# Altium schematic sheet Sheet1.SchDoc
size A4
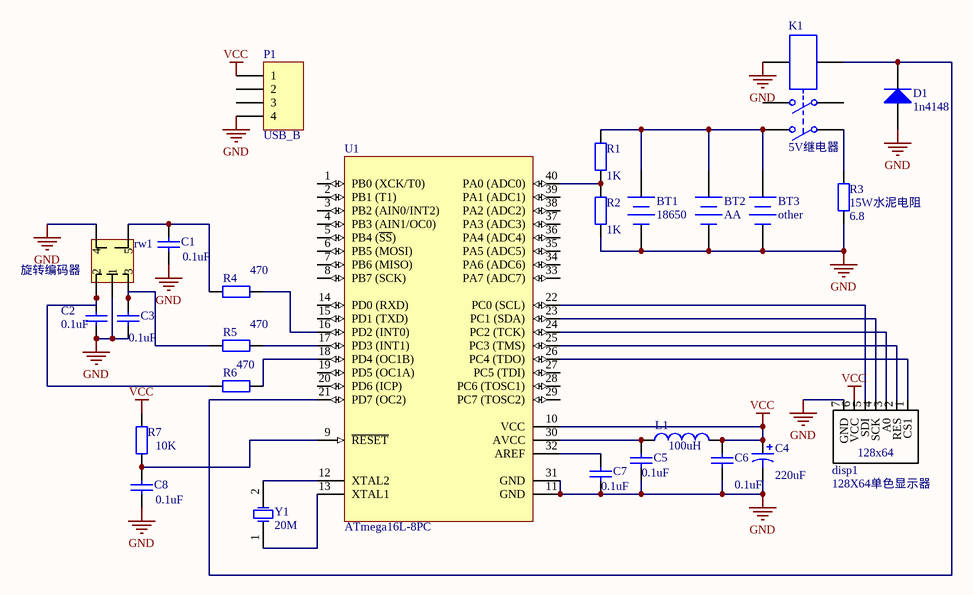
[diagram p0: Sheet1.SchDoc]

## Parts
BT1  18650  [18650battery]
BT2  AA  [aabattery]
BT3  other  [Header2_3.96]
C1  value 0.1uF  [RAD-0.2]  (hidden comment: Cap)
C2  value 0.1uF  [RAD-0.2]  (hidden comment: Cap)
C3  value 0.1uF  [RAD-0.2]  (hidden comment: Cap)
C4  value 220uF  [RB5-10.5]  (hidden comment: Cap Pol1)
C5  value 0.1uF  [RAD-0.2]  (hidden comment: Cap)
C6  value 0.1uF  [RAD-0.2]  (hidden comment: Cap)
C7  value 0.1uF  [RAD-0.2]  (hidden comment: Cap)
C8  value 0.1uF  [RAD-0.2]  (hidden comment: Cap)
D1  1n4148  [DIO10.46-5.3x2.8]
disp1  128X64单色显示器  [mzl05_12864]
K1  5V继电器  [5vrelay]
L1  value 100uH  [AXIAL-0.5]  (hidden comment: Inductor)
P1  USB_B  [USB_B]
R1  value 1K  [AXIAL-0.4]  (hidden comment: Res2)
R2  value 1K  [AXIAL-0.4]  (hidden comment: Res2)
R3  15W水泥电阻  value 6.8  [R_15W]
R4  value 470  [AXIAL-0.4]  (hidden comment: Res2)
R5  value 470  [AXIAL-0.4]  (hidden comment: Res2)
R6  value 470  [AXIAL-0.4]  (hidden comment: Res2)
R7  value 10K  [AXIAL-0.4]  (hidden comment: Res2)
rw1  旋转编码器  [rotate_switch]
U1  ATmega16L-8PC  [40P6]
Y1  20M  [XTAL]

## Nets
GND: BT1.2(-) BT2.2(-) BT3.2(-) C1.2 C2.2 C3.2 C4.2 C5.1 C6.2 C7.1 C8.1 D1.1(A) disp1.7(GND) K1.6 P1.4 R2.1 R3.1 rw1.1 rw1.4 U1.11(GND) U1.31(GND)
VCC: C4.1 C6.1 disp1.6(VCC) L1.2 P1.1 R7.2 U1.10(VCC)
NetBT1_1: BT1.1(+) BT2.1(+) BT3.1(+) K1.2 R1.2
NetC1_1: C1.1 R4.1 rw1.5
NetC2_1: C2.1 R6.1 rw1.2
NetC3_1: C3.1 R5.1 rw1.3
NetC5_2: C5.2 L1.1 U1.30(AVCC)
NetC7_2: C7.2 U1.32(AREF)
NetC8_2: C8.2 R7.1 U1.9(~{RESET})
NetD1_2: D1.2(K) K1.5 U1.21(PD7_(OC2))
Netdisp1_1: disp1.1(CS1) U1.26(PC4_(TDO))
Netdisp1_2: disp1.2(RES) U1.25(PC3_(TMS))
Netdisp1_3: disp1.3(A0) U1.24(PC2_(TCK))
Netdisp1_4: disp1.4(SCK) U1.23(PC1_(SDA))
Netdisp1_5: disp1.5(SDI) U1.22(PC0_(SCL))
NetK1_1: K1.1 R3.2
NetR1_1: R1.1 R2.2 U1.40(PA0_(ADC0))
NetR4_2: R4.2 U1.16(PD2_(INT0))
NetR5_2: R5.2 U1.17(PD3_(INT1))
NetR6_2: R6.2 U1.18(PD4_(OC1B))
NetU1_12: U1.12(XTAL2) Y1.2(OSC2)
NetU1_13: U1.13(XTAL1) Y1.1(OSC1)

Not connected (* = marked no-connect by the designer): K1 3 4; P1 2 3; U1 1(PB0_(XCK/T0)) 2(PB1_(T1)) 3(PB2_(AIN0/INT2)) 4(PB3_(AIN1/OC0)) 5(PB4_(~{SS})) 6(PB5_(MOSI)) 7(PB6_(MISO)) 8(PB7_(SCK)) 14(PD0_(RXD)) 15(PD1_(TXD)) 19(PD5_(OC1A)) 20(PD6_(ICP)) 27(PC5_(TDI)) 28(PC6_(TOSC1)) 29(PC7_(TOSC2)) 33(PA7_(ADC7)) 34(PA6_(ADC6)) 35(PA5_(ADC5)) 36(PA4_(ADC4)) 37(PA3_(ADC3)) 38(PA2_(ADC2)) 39(PA1_(ADC1))

## Notes on the sheet
- (in symbol mzl05_12864) 128x64

## Library data of the parts
BT1-BT3 = Battery: Multicell Battery; Published: 24-Mar-1999; LatestRevisionDate: 17-Jul-2002; LatestRevisionNote: Re-released for DXP Platform.; PackageReference: BAT-2; Publisher: Altium Limited
C1-C3 C5-C8 = Cap: Capacitor; Published: 8-Jun-2000; LatestRevisionDate: 17-Jul-2002; LatestRevisionNote: Re-released for DXP Platform.; PackageReference: RAD-0.3; Publisher: Altium Limited
C4 = Cap Pol1: Polarized Capacitor (Radial); Published: 8-Jun-2000; LatestRevisionDate: 17-Jul-2002; LatestRevisionNote: Re-released for DXP Platform.; PackageReference: RB7.6-15; Publisher: Altium Limited
D1 = Diode 1N4001: 1 Amp General Purpose Rectifier; Published: 8-Jun-2000; LatestRevisionDate: 17-Jul-2002; LatestRevisionNote: Re-released for DXP Platform.; DatasheetVersion: 1998; PackageVersion: Aug-1999; PackageReference: DO-41; Publisher: Altium Limited; Code_JEDEC: DO-204-AL; ComponentLink1Description: Manufacturer Link; ComponentLink1URL: http://www.fairchildsemi.com/; ComponentLink2Description: Datasheet; ComponentLink2URL: http://www.fairchildsemi.com/ds/1N%2F1N4001.pdf
disp1 = mzl05_12864
K1 = Relay-DPST: Dual-Pole Single-Throw Relay; Published: 24-Mar-1999; LatestRevisionDate: 17-Jul-2002; LatestRevisionNote: Re-released for DXP Platform.; PackageReference: MODULE6; Publisher: Altium Limited
L1 = Inductor: Code_IEC: 1005; Published: 8-Jun-2000; LatestRevisionDate: 29-May-2009; LatestRevisionNote: IPC-7351 Footprint Added.; PackageReference: 0402-A; Publisher: Altium Limited; PackageDescription: Chip Inductor; Code_JEITA: 0402
P1 = Header 4: Header, 4-Pin; LatestRevisionDate: 17-Jul-2002; LatestRevisionNote: Re-released for DXP Platform.; Publisher: Altium Limited
R1-R7 = Res2: Resistor; Published: 8-Jun-2000; LatestRevisionDate: 17-Jul-2002; LatestRevisionNote: Re-released for DXP Platform.; PackageReference: AXIAL-0.4; Publisher: Altium Limited
rw1 = rotate_switch
U1 = ATmega16L-8PC: 8-Bit AVR Microcontroller with 16K Bytes of In-System Programmable Flash Memory; Published: 17-Sep-2003; LatestRevisionDate: 04-Mar-2005; LatestRevisionNote: Stylized 3D Model Added.; DatasheetVersion: 2466E-AVR-10/02; PackageVersion: Dec-1999; PackageReference: 40P6; Publisher: Altium Limited; PackageDescription: DIP; 40 Leads; Row Spacing 15.24 mm; Pitch 2.54 mm; ComponentLink1Description: Manufacturer Link; ComponentLink1URL: http://www.atmel.com; ComponentLink2Description: Datasheet; ComponentLink2URL: http://www.atmel.com/dyn/resources/prod_documents/doc2466.pdf
Y1 = XTAL: Crystal Oscillator; Published: 8-Jun-2000; LatestRevisionDate: 17-Jul-2002; LatestRevisionNote: Re-released for DXP Platform.; PackageReference: R38; Publisher: Altium Limited